# Altium schematic sheet MCU.SchDoc: =ProjectName
size A3; Author: Ven
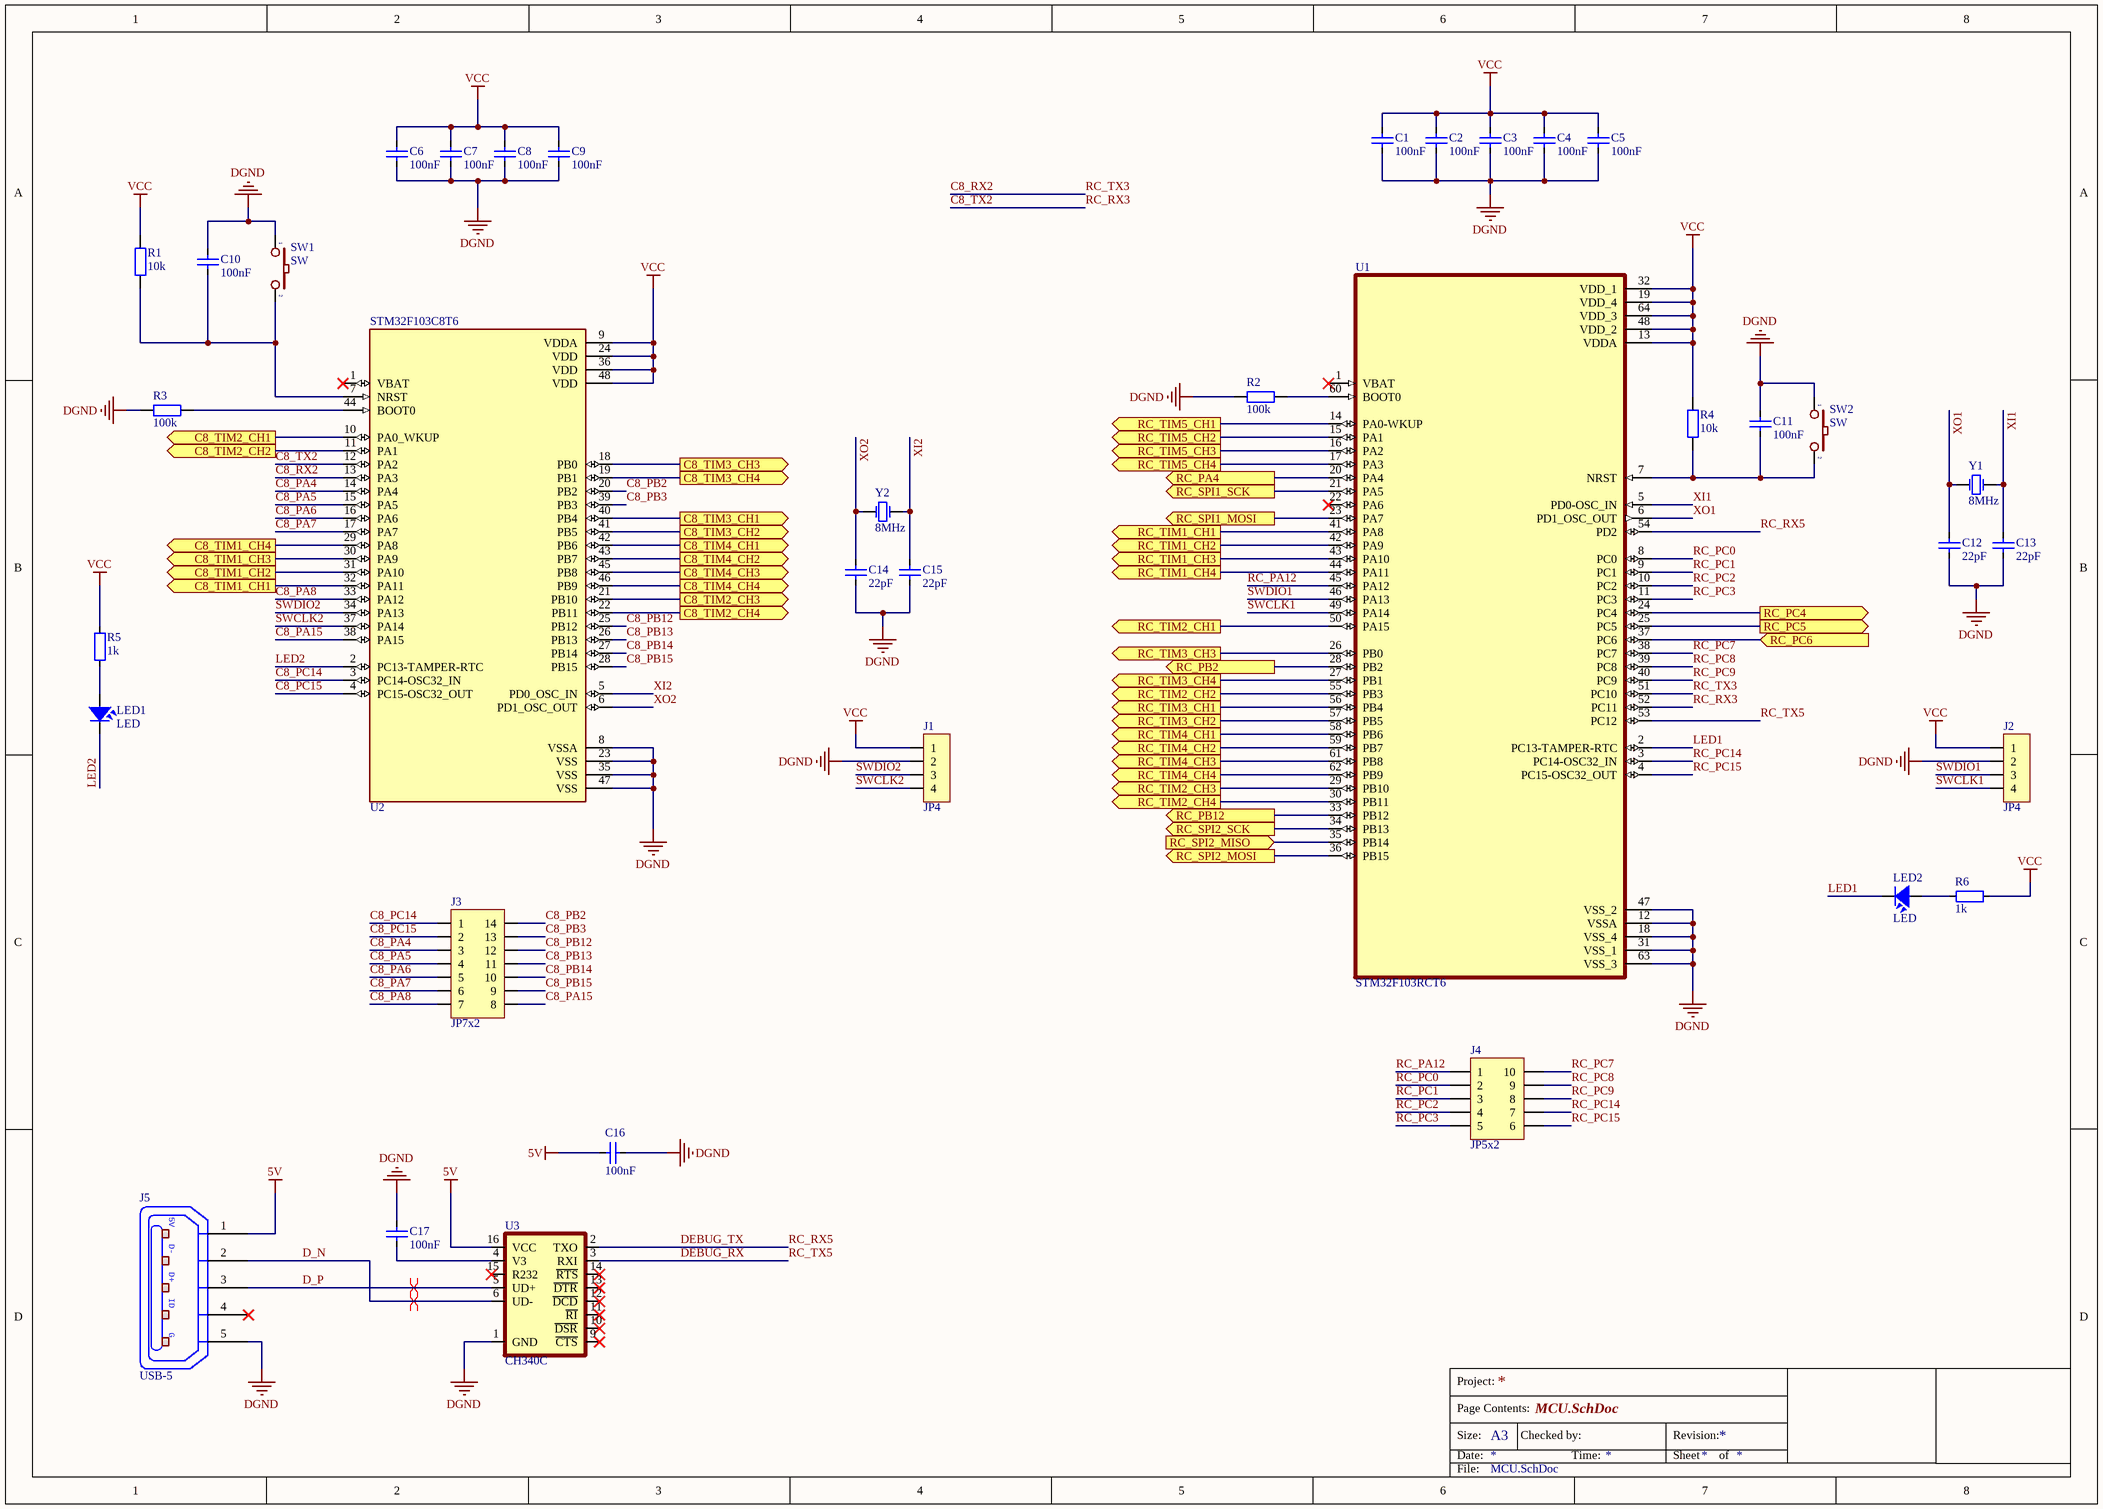
[diagram p0: MCU.SchDoc]

## Parts
C1  100nF  [CAP_0805]
C2  100nF  [CAP_0805]
C3  100nF  [CAP_0805]
C4  100nF  [CAP_0805]
C5  100nF  [CAP_0805]
C6  100nF  [CAP_0805]
C7  100nF  [CAP_0805]
C8  100nF  [CAP_0805]
C9  100nF  [CAP_0805]
C10  100nF  [CAP_0805]
C11  100nF  [CAP_0805]
C12  22pF  [CAP_0805]
C13  22pF  [CAP_0805]
C14  22pF  [CAP_0805]
C15  22pF  [CAP_0805]
C16  100nF  [CAP_0805]
C17  100nF  [CAP_0805]
J1  JP4  [JP4-C1T]
J2  JP4  [JP4-C1T]
J3  JP7x2  [JP7-D2T]
J4  JP5x2  [JP5-D2T]
J5  USB-5  [USB-M1]
LED1  LED  [LED-0805-Green]
LED2  LED  [LED-0805-Green]
R1  10k  [RES-SMD-0805]
R2  100k  [RES-SMD-0805]
R3  100k  [RES-SMD-0805]
R4  10k  [RES-SMD-0805]
R5  1k  [RES-SMD-0805]
R6  1k  [RES-SMD-0805]
SW1  SW  [SW 3x2x4]
SW2  SW  [SW 3x2x4]
U1  STM32F103RCT6  [QFP50P1200X1200X160-64N]
U2  STM32F103C8T6  [LQFP 48]
U3  CH340C  [SO016]
Y1  8MHz  [XTAL 5032 SMD]
Y2  8MHz  [XTAL 5032 SMD]

## Ports
C8_TIM1_CH1 (out), C8_TIM1_CH2 (out), C8_TIM1_CH3 (out), C8_TIM1_CH4 (out), C8_TIM2_CH1 (out), C8_TIM2_CH2 (out), C8_TIM2_CH3 (out), C8_TIM2_CH4 (out), C8_TIM3_CH1 (out), C8_TIM3_CH2 (out), C8_TIM3_CH3 (out), C8_TIM3_CH4 (out), C8_TIM4_CH1 (out), C8_TIM4_CH2 (out), C8_TIM4_CH3 (out), C8_TIM4_CH4 (out), RC_PA4 (out), RC_PB2 (out), RC_PB12 (out), RC_PC4 (out), RC_PC5 (out), RC_PC6 (in), RC_SPI1_MOSI (out), RC_SPI1_SCK (out), RC_SPI2_MISO (in), RC_SPI2_MOSI (out), RC_SPI2_SCK (out), RC_TIM1_CH1 (out), RC_TIM1_CH2 (out), RC_TIM1_CH3 (out), RC_TIM1_CH4 (out), RC_TIM2_CH1 (out), RC_TIM2_CH2 (out), RC_TIM2_CH3 (out), RC_TIM2_CH4 (out), RC_TIM3_CH1 (out), RC_TIM3_CH2 (out), RC_TIM3_CH3 (out), RC_TIM3_CH4 (out), RC_TIM4_CH1 (out), RC_TIM4_CH2 (out), RC_TIM4_CH3 (out), RC_TIM4_CH4 (out), RC_TIM5_CH1 (out), RC_TIM5_CH2 (out), RC_TIM5_CH3 (out), RC_TIM5_CH4 (out)

## Nets
5V: C16.2 J5.1(P1) U3.16(VCC)
DGND: C1.2 C2.2 C3.2 C4.2 C5.2 C6.2 C7.2 C8.2 C9.2 C10.1 C11.1 C12.1 C13.1 C14.1 C15.1 C16.1 C17.2 J1.2 J2.2 J5.5(P5) R2.1 R3.1 SW1.1 SW2.1 U1.12(VSSA) U1.18(VSS_4) U1.31(VSS_1) U1.47(VSS_2) U1.63(VSS_3) U2.8(VSSA) U2.23(VSS) U2.35(VSS) U2.47(VSS) U3.1(GND)
VCC: C1.1 C2.1 C3.1 C4.1 C5.1 C6.1 C7.1 C8.1 C9.1 J1.1 J2.1 R1.1 R4.1 R5.1 R6.1 U1.13(VDDA) U1.19(VDD_4) U1.32(VDD_1) U1.48(VDD_2) U1.64(VDD_3) U2.9(VDDA) U2.24(VDD) U2.36(VDD) U2.48(VDD)
C8_PA4: J3.3 U2.14(PA4)
C8_PA5: J3.4 U2.15(PA5)
C8_PA6: J3.5 U2.16(PA6)
C8_PA7: J3.6 U2.17(PA7)
C8_PA8: J3.7 U2.33(PA12)
C8_PA15: J3.8 U2.38(PA15)
C8_PB2: J3.14 U2.20(PB2)
C8_PB3: J3.13 U2.39(PB3)
C8_PB12: J3.12 U2.25(PB12)
C8_PB13: J3.11 U2.26(PB13)
C8_PB14: J3.10 U2.27(PB14)
C8_PB15: J3.9 U2.28(PB15)
C8_PC14: J3.1 U2.3(PC14-OSC32_IN)
C8_PC15: J3.2 U2.4(PC15-OSC32_OUT)
C8_RX2: U1.51(PC10) U2.13(PA3)  [also labelled RC_TX3]
C8_TIM1_CH1: U2.32(PA11) ; port C8_TIM1_CH1
C8_TIM1_CH2: U2.31(PA10) ; port C8_TIM1_CH2
C8_TIM1_CH3: U2.30(PA9) ; port C8_TIM1_CH3
C8_TIM1_CH4: U2.29(PA8) ; port C8_TIM1_CH4
C8_TIM2_CH1: U2.10(PA0_WKUP) ; port C8_TIM2_CH1
C8_TIM2_CH2: U2.11(PA1) ; port C8_TIM2_CH2
C8_TIM2_CH3: U2.21(PB10) ; port C8_TIM2_CH3
C8_TIM2_CH4: U2.22(PB11) ; port C8_TIM2_CH4
C8_TIM3_CH1: U2.40(PB4) ; port C8_TIM3_CH1
C8_TIM3_CH2: U2.41(PB5) ; port C8_TIM3_CH2
C8_TIM3_CH3: U2.18(PB0) ; port C8_TIM3_CH3
C8_TIM3_CH4: U2.19(PB1) ; port C8_TIM3_CH4
C8_TIM4_CH1: U2.42(PB6) ; port C8_TIM4_CH1
C8_TIM4_CH2: U2.43(PB7) ; port C8_TIM4_CH2
C8_TIM4_CH3: U2.45(PB8) ; port C8_TIM4_CH3
C8_TIM4_CH4: U2.46(PB9) ; port C8_TIM4_CH4
C8_TX2: U1.52(PC11) U2.12(PA2)  [also labelled RC_RX3]
D_N: J5.2(P2) U3.6(UD-)
D_P: J5.3(P3) U3.5(UD+)
DEBUG_RX: U1.53(PC12) U3.3(RXI)  [also labelled RC_TX5]
DEBUG_TX: U1.54(PD2) U3.2(TXO)  [also labelled RC_RX5]
LED1: LED2.2 U1.2(PC13-TAMPER-RTC)
LED2: LED1.2 U2.2(PC13-TAMPER-RTC)
RC_PA4: U1.20(PA4) ; port RC_PA4
RC_PA12: J4.1 U1.45(PA12)
RC_PB2: U1.28(PB2) ; port RC_PB2
RC_PB12: U1.33(PB12) ; port RC_PB12
RC_PC0: J4.2 U1.8(PC0)
RC_PC1: J4.3 U1.9(PC1)
RC_PC2: J4.4 U1.10(PC2)
RC_PC3: J4.5 U1.11(PC3)
RC_PC4: U1.24(PC4) ; port RC_PC4
RC_PC5: U1.25(PC5) ; port RC_PC5
RC_PC6: U1.37(PC6) ; port RC_PC6
RC_PC7: J4.10 U1.38(PC7)
RC_PC8: J4.9 U1.39(PC8)
RC_PC9: J4.8 U1.40(PC9)
RC_PC14: J4.7 U1.3(PC14-OSC32_IN)
RC_PC15: J4.6 U1.4(PC15-OSC32_OUT)
RC_SPI1_MOSI: U1.23(PA7) ; port RC_SPI1_MOSI
RC_SPI1_SCK: U1.21(PA5) ; port RC_SPI1_SCK
RC_SPI2_MISO: U1.35(PB14) ; port RC_SPI2_MISO
RC_SPI2_MOSI: U1.36(PB15) ; port RC_SPI2_MOSI
RC_SPI2_SCK: U1.34(PB13) ; port RC_SPI2_SCK
RC_TIM1_CH1: U1.41(PA8) ; port RC_TIM1_CH1
RC_TIM1_CH2: U1.42(PA9) ; port RC_TIM1_CH2
RC_TIM1_CH3: U1.43(PA10) ; port RC_TIM1_CH3
RC_TIM1_CH4: U1.44(PA11) ; port RC_TIM1_CH4
RC_TIM2_CH1: U1.50(PA15) ; port RC_TIM2_CH1
RC_TIM2_CH2: U1.55(PB3) ; port RC_TIM2_CH2
RC_TIM2_CH3: U1.29(PB10) ; port RC_TIM2_CH3
RC_TIM2_CH4: U1.30(PB11) ; port RC_TIM2_CH4
RC_TIM3_CH1: U1.56(PB4) ; port RC_TIM3_CH1
RC_TIM3_CH2: U1.57(PB5) ; port RC_TIM3_CH2
RC_TIM3_CH3: U1.26(PB0) ; port RC_TIM3_CH3
RC_TIM3_CH4: U1.27(PB1) ; port RC_TIM3_CH4
RC_TIM4_CH1: U1.58(PB6) ; port RC_TIM4_CH1
RC_TIM4_CH2: U1.59(PB7) ; port RC_TIM4_CH2
RC_TIM4_CH3: U1.61(PB8) ; port RC_TIM4_CH3
RC_TIM4_CH4: U1.62(PB9) ; port RC_TIM4_CH4
RC_TIM5_CH1: U1.14(PA0-WKUP) ; port RC_TIM5_CH1
RC_TIM5_CH2: U1.15(PA1) ; port RC_TIM5_CH2
RC_TIM5_CH3: U1.16(PA2) ; port RC_TIM5_CH3
RC_TIM5_CH4: U1.17(PA3) ; port RC_TIM5_CH4
SWCLK1: J2.4 U1.49(PA14)
SWCLK2: J1.4 U2.37(PA14)
SWDIO1: J2.3 U1.46(PA13)
SWDIO2: J1.3 U2.34(PA13)
XI1: C13.2 U1.5(PD0-OSC_IN) Y1.2(OSC2)
XI2: C15.2 U2.5(PD0_OSC_IN) Y2.2(OSC2)
XO1: C12.2 U1.6(PD1_OSC_OUT) Y1.1(OSC1)
XO2: C14.2 U2.6(PD1_OSC_OUT) Y2.1(OSC1)
NetC10_2: C10.2 R1.2 SW1.2 U2.7(NRST)
NetC11_2: C11.2 R4.2 SW2.2 U1.7(NRST)
NetC17_1: C17.1 U3.4(V3)
NetLED1_1: LED1.1 R5.2
NetLED2_1: LED2.1 R6.2
NetR2_2: R2.2 U1.60(BOOT0)
NetR3_2: R3.2 U2.44(BOOT0)

Not connected (* = marked no-connect by the designer): J5 4(P4)*; U1 1(VBAT)* 22(PA6)*; U2 1(VBAT)*; U3 9(~{CTS})* 10(~{DSR})* 11(~{RI})* 12(~{DCD})* 13(~{DTR})* 14(~{RTS})* 15(R232)*

## Layout directives
differential pair: D_N, D_P

## Notes on the sheet
- Project:
- Page Contents:
- Size:
- Date:
- A3
- Checked by:
- Time:
- Revision:
- Sheet
- of
- File:
- (in symbol USB-5) 5V; D-; D+; ID; G

## Library data of the parts
C1-C17 = CapSMD: Capacitor; Value: 33p; Published: 8-Jun-2000; LatestRevisionDate: 17-Jul-2002; LatestRevisionNote: Re-released for DXP Platform.; PackageReference: RAD-0.3; Publisher: Altium Limited
J1 J2 = JP4: WR-PHD 2.54 mm Angled Socket Header; Manufacturer: W¨¹rth Elektronik eiSos GmbH; partNo: 613004143121; ComponentLink1 Description: Manufacturer; ComponentLink2 Description: Datasheet; NoPins: 04; Created Date: 29 March 2013; ComponentLink1URL: http://www.we-online.com; ComponentLink2URL: http://katalog.we-online.de/em/datasheet/6130xx143121.pdf; Created by: Karrer Zheng
J3 = JP7x2: WR-PHD 2.54 mm Dual Socket Header; Manufacturer: W¨¹rth Elektronik eiSos GmbH; partNo: 61301421821; ComponentLink1 Description: Manufacturer; ComponentLink2 Description: Datasheet; NoPins: 14; Created Date: 29 March 2013; ComponentLink1URL: http://www.we-online.com; ComponentLink2URL: http://katalog.we-online.de/em/datasheet/6130xx21821.pdf; Created by: Karrer Zheng
J4 = JP5x2: WR-PHD 2.54 mm Dual Socket Header; Manufacturer: W¨¹rth Elektronik eiSos GmbH; partNo: 61301021821; ComponentLink1 Description: Manufacturer; ComponentLink2 Description: Datasheet; NoPins: 10; Created Date: 29 March 2013; ComponentLink1URL: http://www.we-online.com; ComponentLink2URL: http://katalog.we-online.de/em/datasheet/6130xx21821.pdf; Created by: Karrer Zheng
J5 = USB-5: Manufacturer: FCI; Manufacturer Part Number: 10118193-0001LF; Connector Type: USB - micro B; Number of Contacts: 5; Gender: Receptacle; Specifications: USB 2.0; .Creator: MM; .Checked PCB: RF; Supplier 1: Digi-Key; RoHS: RoHS Compliant; Category: Connectors, Interconnects; Stock 1: 28642; Pricing 1: 1=0.46, 10=0.433, 25=0.3712, 50=0.3156, 100=0.3032, 250=0.27224, 500=0.25988 (USD); Packaging: Cut Tape (CT); Mounting Type: Surface Mount, Right Angle, Horizontal; Features: Shielded, Solder Retention; Ingress Protection: -; ComponentLink1URL: http://portal.fciconnect.com/Comergent//fci/drawing/10118193.pdf; ComponentLink1Description: http://portal.fciconnect.com/Comergent//fci/drawing/10118193.pdf; Supplier Part Number 1: 609-4616-1-ND; .Checked SCH: MM
LED1 LED2 = LED: LED Single colour Green and Red; Value: LED 3 ly Single Colour
R1-R4 = Resistor - SMD: Resistor SMD; Manufacturer: Generic Components; Class: Passive; Published: 08/06/2000; Publisher: Altium Hobart Technology Centre
R5 R6 = Resistor - SMD: Resistor; Manufacturer: Generic Components; Class: Passive; Published: 08/06/2000; Publisher: Altium Hobart Technology Centre
SW1 SW2 = SW2: Switch button 2 pin; Value: SW chip 2 pin
U1 = STM32F103RCT6: STM32 ARM-based 32-bit MCU 72MHz 256KB
U2 = STM32F103C8T6: STM32 ARM-based 32-bit MCU with 64 Kbytes Flash, 64-pin LQFP, Industrial Temperature
U3 = CH340C: USB to serial chip CH340; MF: WCH; Package: Package; Check_prices: https://www.snapeda.com/parts/CH340C/WCH/view-part/5428851/?ref=eda; Value: *; Price: None; MP: CH340C; Availability: Unavailable; SnapEDA_Link: https://www.snapeda.com/parts/CH340C/WCH/view-part/5428851/?ref=snap
Y1 Y2 = XTAL: Crystal Oscillator; Published: 8-Jun-2000; LatestRevisionDate: 17-Jul-2002; LatestRevisionNote: Re-released for DXP Platform.; PackageReference: R38; Publisher: Altium Limited